# Altium schematic sheet Display.SchDoc: Soldeerstation
size A4; SheetNumber: 5; SheetTotal: 5
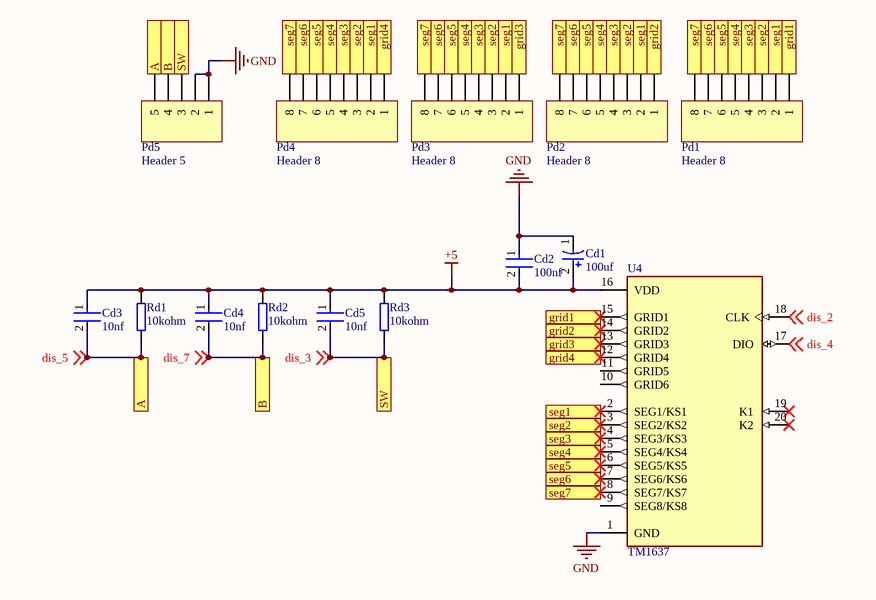
[diagram p0: Display.SchDoc]

## Parts
Cd1  100uf  [CE_D8_L10]
Cd2  100nf  [CC_0805_L]
Cd3  10nf  [CC_0805_L]
Cd4  10nf  [CC_0805_L]
Cd5  10nf  [CC_0805_L]
Pd1  Header 8  [HDR1X8]
Pd2  Header 8  [HDR1X8]
Pd3  Header 8  [HDR1X8]
Pd4  Header 8  [HDR1X8]
Pd5  Header 5  [HDR1X5]
Rd1  10kohm  [R_0805_L]
Rd2  10kohm  [R_0805_L]
Rd3  10kohm  [R_0805_L]
U4  TM1637  [SOP_20_M]

## Ports
A, B, grid1, grid2, grid3, grid4, seg1, seg2, seg3, seg4, seg5, seg6, seg7, SW

## Nets
+5: Cd1.2 Cd2.2 Cd3.1 Cd4.1 Cd5.1 Rd1.2 Rd2.2 Rd3.2 U4.16(VDD)
GND: Cd1.1 Cd2.1 Pd5.1 Pd5.2 U4.1(GND)
dis_2: U4.18(CLK) ; off-sheet dis_2
dis_3: Cd5.2 Pd5.3 Rd3.1 ; off-sheet dis_3, port SW
dis_4: U4.17(DIO) ; off-sheet dis_4
dis_5: Cd3.2 Pd5.5 Rd1.1 ; off-sheet dis_5, port A
dis_7: Cd4.2 Pd5.4 Rd2.1 ; off-sheet dis_7, port B
grid1: Pd1.1 U4.15(GRID1) ; port grid1
grid2: Pd2.1 U4.14(GRID2) ; port grid2
grid3: Pd3.1 U4.13(GRID3) ; port grid3
grid4: Pd4.1 U4.12(GRID4) ; port grid4
seg1: Pd1.2 Pd2.2 Pd3.2 Pd4.2 U4.2(SEG1/KS1) ; port seg1
seg2: Pd1.3 Pd2.3 Pd3.3 Pd4.3 U4.3(SEG2/KS2) ; port seg2
seg3: Pd1.4 Pd2.4 Pd3.4 Pd4.4 U4.4(SEG3/KS3) ; port seg3
seg4: Pd1.5 Pd2.5 Pd3.5 Pd4.5 U4.5(SEG4/KS4) ; port seg4
seg5: Pd1.6 Pd2.6 Pd3.6 Pd4.6 U4.6(SEG5/KS5) ; port seg5
seg6: Pd1.7 Pd2.7 Pd3.7 Pd4.7 U4.7(SEG6/KS6) ; port seg6
seg7: Pd1.8 Pd2.8 Pd3.8 Pd4.8 U4.8(SEG7/KS7) ; port seg7

Not connected (* = marked no-connect by the designer): U4 9(SEG8/KS8) 10(GRID6) 11(GRID5) 19(K1)* 20(K2)*

## Library data of the parts
Cd1 = Capacitor_Electrolytic: Manufacturer: Panasonic; Voltage Rating: 25 V; ComponentLink2URL: http://industrial.panasonic.com/cdbs/www-data/pdf/RDE0000/ABA0000C1181.pdf; Height: 10.2 mm; Max Operating Temperature: 105 degC; PackageReference: EEE-FK1E221P; ComponentLink1Description: Manufacturer URL; ComponentLink1URL: http://www.panasonic.com/; Mount: Surface Mount; REACH SVHC: No SVHC; Min Operating Temperature: -55 degC; ComponentLink2Description: Datasheet; DatasheetVersion: 03/2016; Length: 10.2 mm; RoHSCompliant: true; Packaging: Tape and Reel; Package Quantity: 500; Lead Pitch: 3.1 mm; Pins: 2; PackageDescription: 2-Pin Electrolytic Aluminum Capacitor, Body 8.3 x 8.3 mm; Mounting Technology: Surface Mount
Cd2-Cd5 = Capacitor_Ceramic: Manufacturer: KEMET; Manufacturer Part Number: C0805C224K5RACTU; Value: 0.22 μF; Temperature Characteristic: X7R; Temperature Coefficient: 30ppm/°C; Tolerance: 0.1; Voltage Rating: 50 V; ComponentLink2URL: https://content.kemet.com/datasheets/KEM_C1003_C0G_SMD.pdf; Device Class L3: Ceramic Capacitors; Lead Free: Yes; Temperature: -55°C to +125°C; RoHS: TRUE; Capacitance: 0.22 μF; Automotive: No; Material: Ceramic; Octopart: https://octopart.com/c0805c224k5ractu-kemet-144670; Temperature Range Low: -55°C; Height: 0.88mm; Device Class L1: Passive Components; Digikey Description: CAP CER 0.22UF 50V X7R 0805; ComponentLink2Description: Datasheet; Mouser Description: CAP CER 0.22UF 50V X7R 0805; Category: Cap; Ipc Land Pattern Name: CAPC200125X78; Temperature Range High: +125°C; Package: C0805C-DN; Device Class L2: Capacitors
Pd1-Pd4 = Header 8: Header, 8-Pin; LatestRevisionDate: 17-Jul-2002; LatestRevisionNote: Re-released for DXP Platform.; Publisher: Altium Limited
Pd5 = Header 5: Header, 5-Pin; LatestRevisionDate: 17-Jul-2002; LatestRevisionNote: Re-released for DXP Platform.; Publisher: Altium Limited
Rd1-Rd3 = Resistor: Manufacturer: Vishay Dale; Part Number: CRCW08050000Z0EA
U4 = TM1637: LED Drive Control Special Circuit; MF: Titan Micro Electronics; Package: Package; Availability: Not in stock; SnapEDA_Link: https://www.snapeda.com/parts/TM1637/Titan+Micro+Electronics/view-part/?ref=snap; MP: TM1637; Check_prices: https://www.snapeda.com/parts/TM1637/Titan+Micro+Electronics/view-part/?ref=eda; Value: *; Price: None